# EAGLE design Nixie Board (EAGLE 9.6.2)
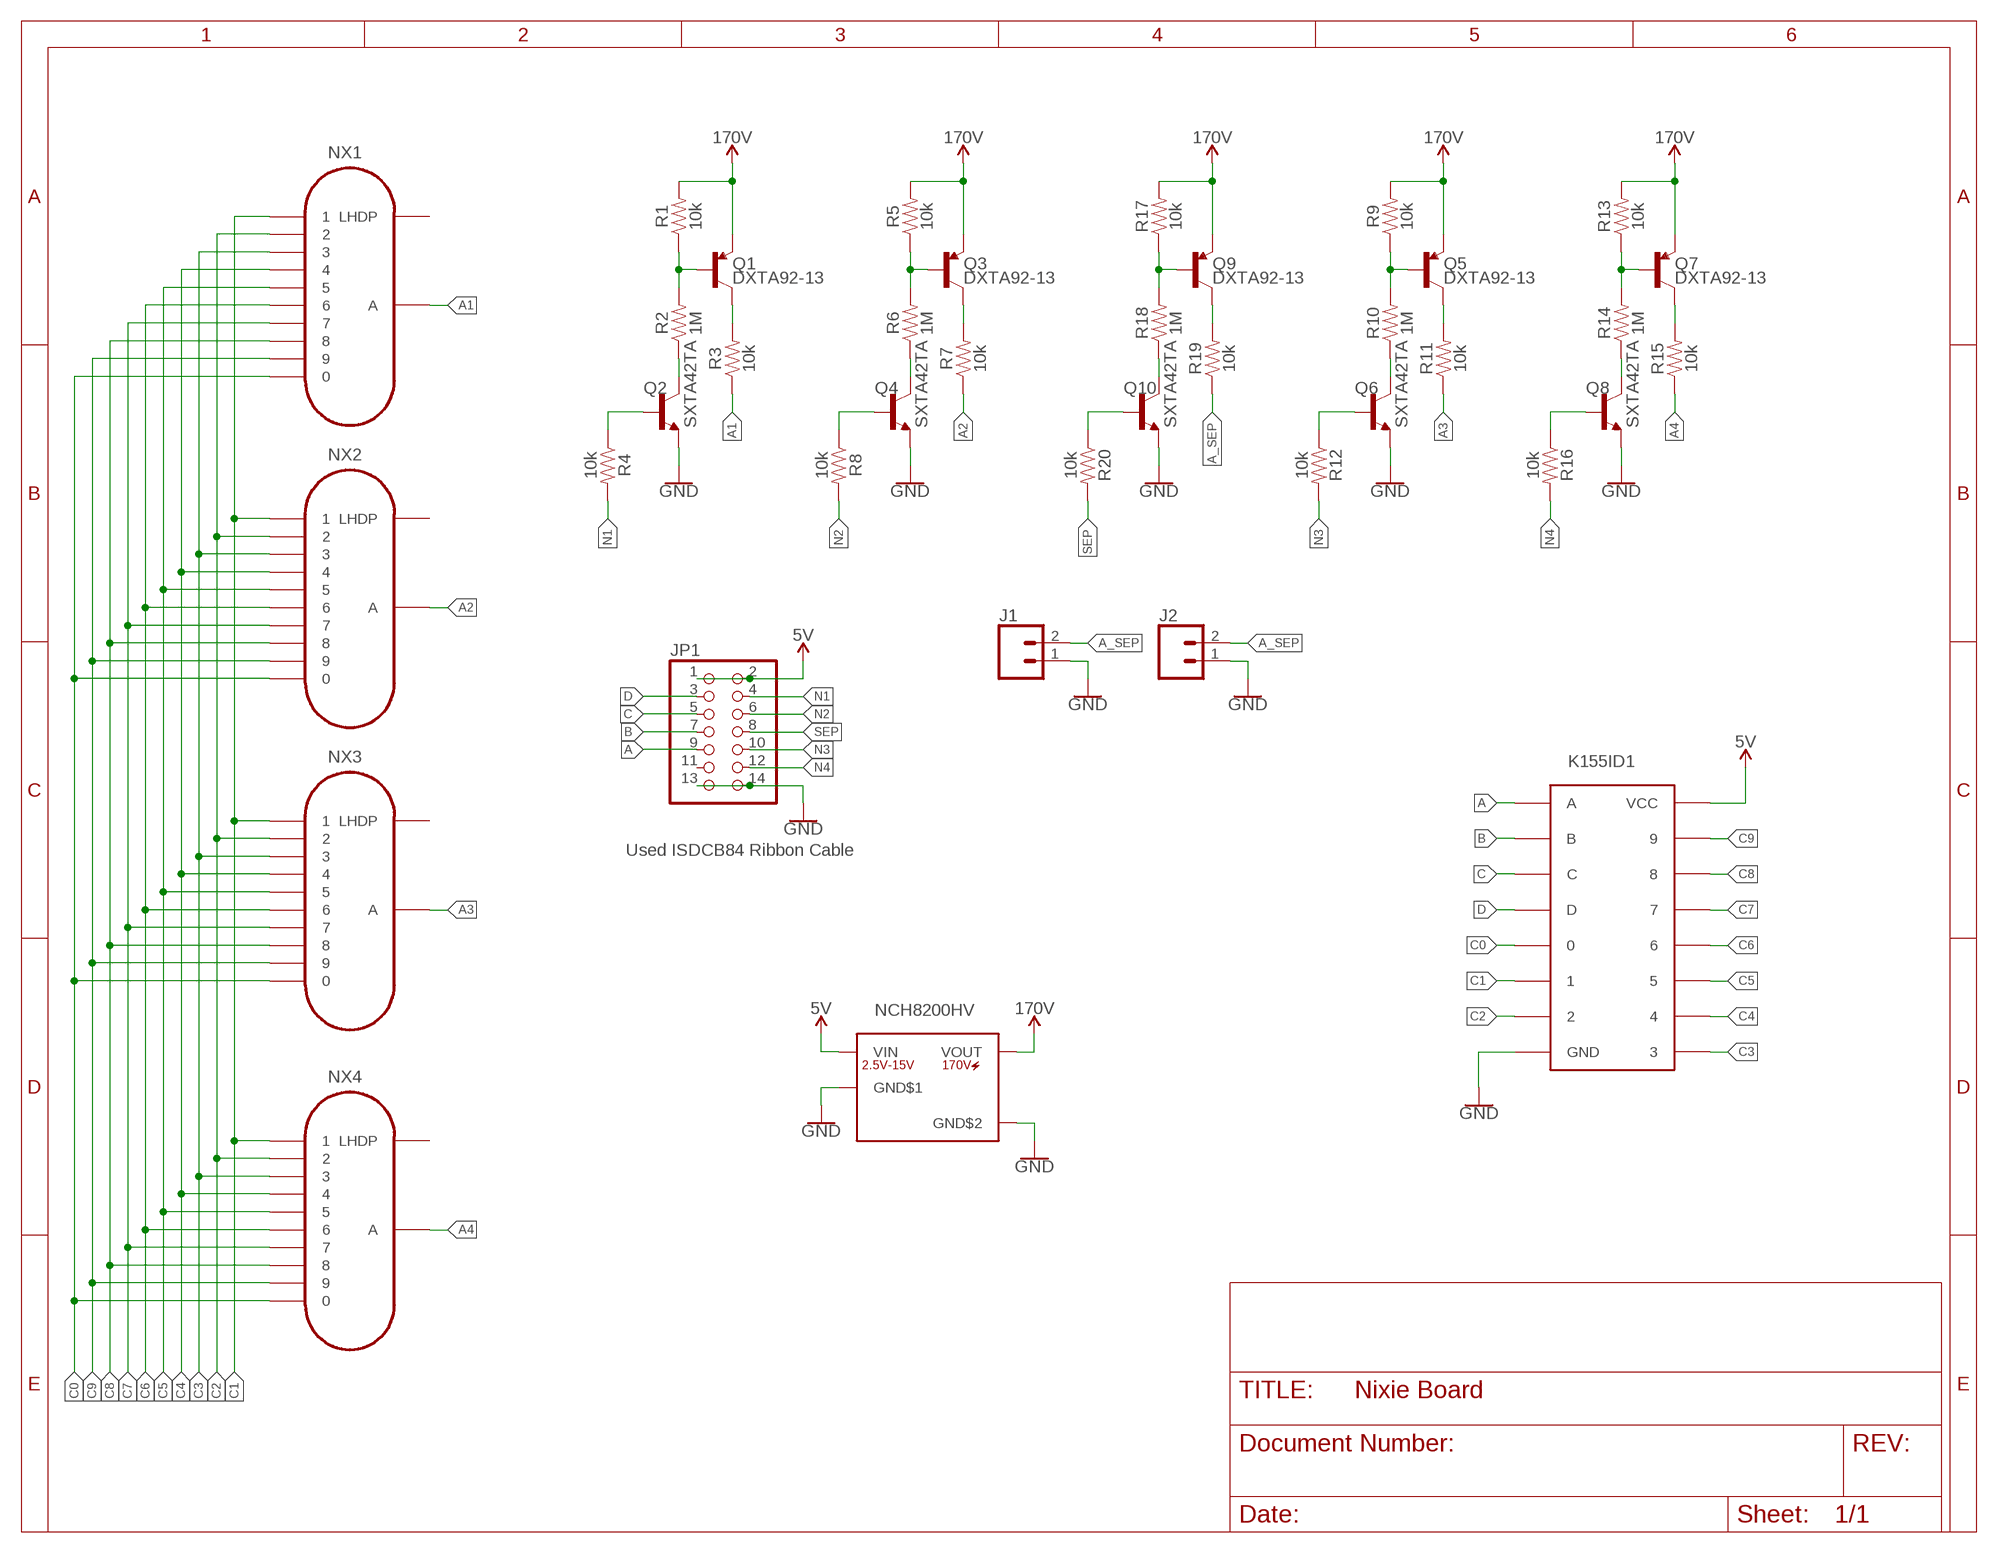
[diagram p0: schematic, sheet 1]

## Parts
J1  CONN_02  [1X02]
J2  CONN_02  [1X02]
JP1  PINHD-2X7  [2X07]
NX1  IN-12BNOHOLE  [IN-12-DSUB-NOHOLE]
NX2  IN-12BNOHOLE  [IN-12-DSUB-NOHOLE]
NX3  IN-12BNOHOLE  [IN-12-DSUB-NOHOLE]
NX4  IN-12BNOHOLE  [IN-12-DSUB-NOHOLE]
Q1  DXTA92-13  [DXTA9213]
Q2  SXTA42TA  [SXTA42TA]
Q3  DXTA92-13  [DXTA9213]
Q4  SXTA42TA  [SXTA42TA]
Q5  DXTA92-13  [DXTA9213]
Q6  SXTA42TA  [SXTA42TA]
Q7  DXTA92-13  [DXTA9213]
Q8  SXTA42TA  [SXTA42TA]
Q9  DXTA92-13  [DXTA9213]
Q10  SXTA42TA  [SXTA42TA]
R1  10k  10KOHM-0603-1/10W-1%  [0603]
R2  1M  1MOHM-0603-1/4W-5%  [0603]
R3  10k  10KOHM-0603-1/10W-1%  [0603]
R4  10k  10KOHM-0603-1/10W-1%  [0603]
R5  10k  10KOHM-0603-1/10W-1%  [0603]
R6  1M  1MOHM-0603-1/4W-5%  [0603]
R7  10k  10KOHM-0603-1/10W-1%  [0603]
R8  10k  10KOHM-0603-1/10W-1%  [0603]
R9  10k  10KOHM-0603-1/10W-1%  [0603]
R10  1M  1MOHM-0603-1/4W-5%  [0603]
R11  10k  10KOHM-0603-1/10W-1%  [0603]
R12  10k  10KOHM-0603-1/10W-1%  [0603]
R13  10k  10KOHM-0603-1/10W-1%  [0603]
R14  1M  1MOHM-0603-1/4W-5%  [0603]
R15  10k  10KOHM-0603-1/10W-1%  [0603]
R16  10k  10KOHM-0603-1/10W-1%  [0603]
R17  10k  10KOHM-0603-1/10W-1%  [0603]
R18  1M  1MOHM-0603-1/4W-5%  [0603]
R19  10k  10KOHM-0603-1/10W-1%  [0603]
R20  10k  10KOHM-0603-1/10W-1%  [0603]
U$1  K155ID1  [DIP16]
U$2  NCH8200HV  [NCH8200HV]

## Nets
5V: JP1.1 JP1.2 U$1.5(VCC) U$2.P$1(VIN)
A: JP1.9 U$1.3(A)
A1: NX1.A R3.1
A2: NX2.A R7.1
A3: NX3.A R11.1
A4: NX4.A R15.1
A_SEP: J1.2 J2.2 R19.1
B: JP1.7 U$1.6(B)
C: JP1.5 U$1.7(C)
C0: NX1.0 NX2.0 NX3.0 NX4.0 U$1.16
C1: NX1.1 NX2.1 NX3.1 NX4.1 U$1.15
C2: NX1.2 NX2.2 NX3.2 NX4.2 U$1.8
C3: NX1.3 NX2.3 NX3.3 NX4.3 U$1.9
C4: NX1.4 NX2.4 NX3.4 NX4.4 U$1.13
C5: NX1.5 NX2.5 NX3.5 NX4.5 U$1.14
C6: NX1.6 NX2.6 NX3.6 NX4.6 U$1.11
C7: NX1.7 NX2.7 NX3.7 NX4.7 U$1.10
C8: NX1.8 NX2.8 NX3.8 NX4.8 U$1.1
C9: NX1.9 NX2.9 NX3.9 NX4.9 U$1.2
D: JP1.3 U$1.4(D)
GND: J1.1 J2.1 JP1.13 JP1.14 Q2.3(E) Q4.3(E) Q6.3(E) Q8.3(E) Q10.3(E) U$1.12(GND) U$2.P$2(GND$1) U$2.P$3(GND$2)
N1: JP1.4 R4.2
N2: JP1.6 R8.2
N3: JP1.10 R12.2
N4: JP1.12 R16.2
N$1: Q1.1(B) R1.1 R2.2
N$2: Q1.2(C) R3.2
N$3: Q2.2(C) R2.1
N$4: Q2.1(B) R4.1
N$5: Q3.1(B) R5.1 R6.2
N$6: Q3.2(C) R7.2
N$7: Q4.2(C) R6.1
N$8: Q4.1(B) R8.1
N$9: Q5.1(B) R9.1 R10.2
N$10: Q5.2(C) R11.2
N$11: Q6.2(C) R10.1
N$12: Q6.1(B) R12.1
N$13: Q7.1(B) R13.1 R14.2
N$14: Q7.2(C) R15.2
N$15: Q8.2(C) R14.1
N$16: Q8.1(B) R16.1
N$17: Q9.1(B) R17.1 R18.2
N$18: Q9.2(C) R19.2
N$19: Q10.2(C) R18.1
N$20: Q10.1(B) R20.1
SEP: JP1.8 R20.2
VCC_1: Q1.3(E) Q3.3(E) Q5.3(E) Q7.3(E) Q9.3(E) R1.2 R5.2 R9.2 R13.2 R17.2 U$2.P$4(VOUT) ; supply symbol labelled 170V
Unconnected: JP1.11 NX1.LHDP NX2.LHDP NX3.LHDP NX4.LHDP

## Notes on the sheet
- K155ID1
- Used ISDCB84 Ribbon Cable
- NCH8200HV

## Library data of the parts
J1 J2 = SparkFun-Connectors:CONN_02: Multi connection point. Often used as Generic Header-pin footprint for 0.1 inch spaced/style header connections On any of the 0.1 inch spaced packages, you can populate with these: Break Away Headers - Straight <https://www.sparkfun.com/products/116> (PRT-00116) Break Away Male Headers - Right Angle <https://www.sparkfun.com/products/553> (PRT-00553) Female Headers <https://www.sparkfun.com/products/115> (PRT-00115) Break Away Headers - Machine Pin <https://www.sparkfun.com/products/117> (PRT-00117) Break Away Female Headers - Swiss Machine Pin <https://www.sparkfun.com/products/743> (PRT-00743) For SCREWTERMINALS and SPRING TERMINALS visit here: Screw Terimnals on SparkFun.com <https://www.sparkfun.com/search/results?term=Screw+Terminals> (5mm/3.5mm/2.54mm spacing) This device is also useful as a general connection point to wire up your design to another part of your project. Our various solder wires solder well into these plated through hole pads. Hook-Up Wire - Assortment (Stranded, 22 AWG) <https://www.sparkfun.com/products/11375> (PRT-11375) Hook-Up Wire - Assortment (Solid Core, 22 AWG) <https://www.sparkfun.com/products/11367> (PRT-11367) View the entire wire category on our website here <https://www.sparkfun.com/categories/141> Special notes: Molex polarized connector foot print use with: PRT-08233 with associated crimp pins and housings. 2.54_SCREWTERM for use with PRT-10571. 3.5mm Screw Terminal footprints for PRT-08084 5mm Screw Terminal footprints for use with PRT-08432; MPN: INS-1
JP1 = pinhead:PINHD-2X7: PIN HEADER; MPN: 30314-6002HB
NX1-NX4 = nixies-us:IN-12B: IN-12B: medium numeric topview nixie tube; MPN: IN-12B
Q1 Q3 Q5 Q7 Q9 = DXTA92-13:DXTA92-13: Bipolar Transistors - BJT 1000mW -300Vceo PNP SURFACE MOUNT TRANSISTOR Source: Datasheet <https://www.diodes.com/assets/Datasheets/ds31159.pdf>; ARROW_PART_NUMBER: DXTA92-13; ARROW_PRICE-STOCK: https://www.arrow.com/en/products/dxta92-13/diodes-incorporated?region=nac; DESCRIPTION: Bipolar Transistors - BJT 1000mW -300Vceo PNP SURFACE MOUNT TRANSISTOR; HEIGHT: 1.6mm; MANUFACTURER_NAME: Diodes Inc.; MANUFACTURER_PART_NUMBER: DXTA92-13; MOUSER_PART_NUMBER: 621-DXTA92-13; MOUSER_PRICE-STOCK: https://www.mouser.com/Search/Refine.aspx?Keyword=621-DXTA92-13; MPN: DXTA92-13
Q2 Q4 Q6 Q8 Q10 = SXTA42TA:SXTA42TA: Diodes Inc SXTA42TA NPN High Voltage Bipolar Transistor, 500 mA, 300 V, 4-Pin SOT-89 Source: Datasheet <https://www.diodes.com/assets/Datasheets/SXTA42.pdf>; ARROW_PART_NUMBER: SXTA42TA; ARROW_PRICE-STOCK: https://www.arrow.com/en/products/sxta42ta/diodes-incorporated?region=nac; DESCRIPTION: Diodes Inc SXTA42TA NPN High Voltage Bipolar Transistor, 500 mA, 300 V, 4-Pin SOT-89; HEIGHT: 1.5mm; MANUFACTURER_NAME: Diodes Inc.; MANUFACTURER_PART_NUMBER: SXTA42TA; MOUSER_PART_NUMBER: 522-SXTA42TA; MOUSER_PRICE-STOCK: https://www.mouser.co.uk/ProductDetail/Diodes-Incorporated/SXTA42TA?qs=GBLSl2AkiruGQsPJmKRQDg%3D%3D; MPN: SXTA42TA
R1 R3-R5 R7-R9 R11-R13 R15-R17 R19 R20 = SparkFun-Resistors:10KOHM: 10kΩ resistor A resistor is a passive two-terminal electrical component that implements electrical resistance as a circuit element. Resistors act to reduce current flow, and, at the same time, act to lower voltage levels within circuits. - Wikipedia; MPN: ESR03EZPJ103; PROD_ID: RES-00824
R2 R6 R10 R14 R18 = SparkFun-Resistors:1MOHM: 1MΩ resistor A resistor is a passive two-terminal electrical component that implements electrical resistance as a circuit element. Resistors act to reduce current flow, and, at the same time, act to lower voltage levels within circuits. - Wikipedia; MPN: ERJ-3EKF1004V; PROD_ID: RES-07868
U$1 = SparkFun-IC-Logic:K155ID1; MPN: K155ID1
U$2 = nixies-us:NCH8200HV; MPN: NCH8200HV

## Board
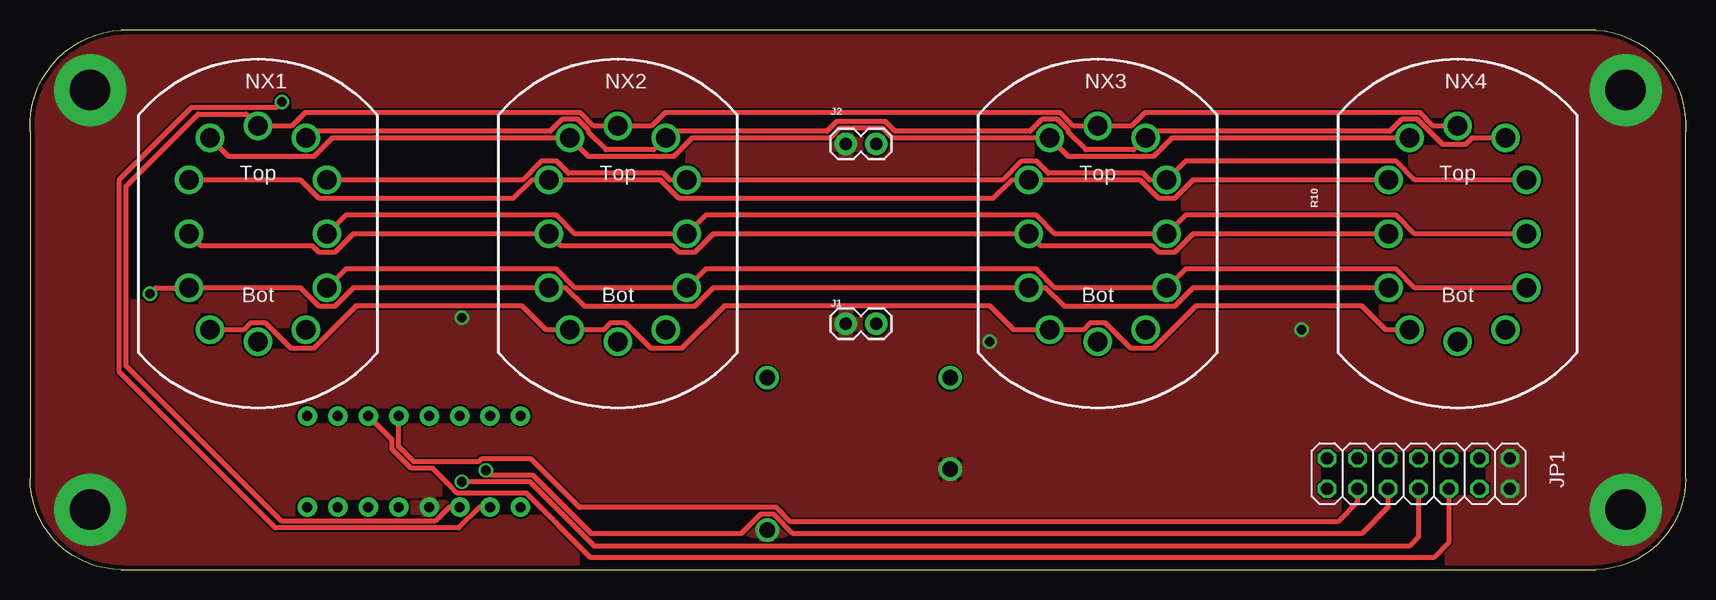
[diagram p1: board, top side]
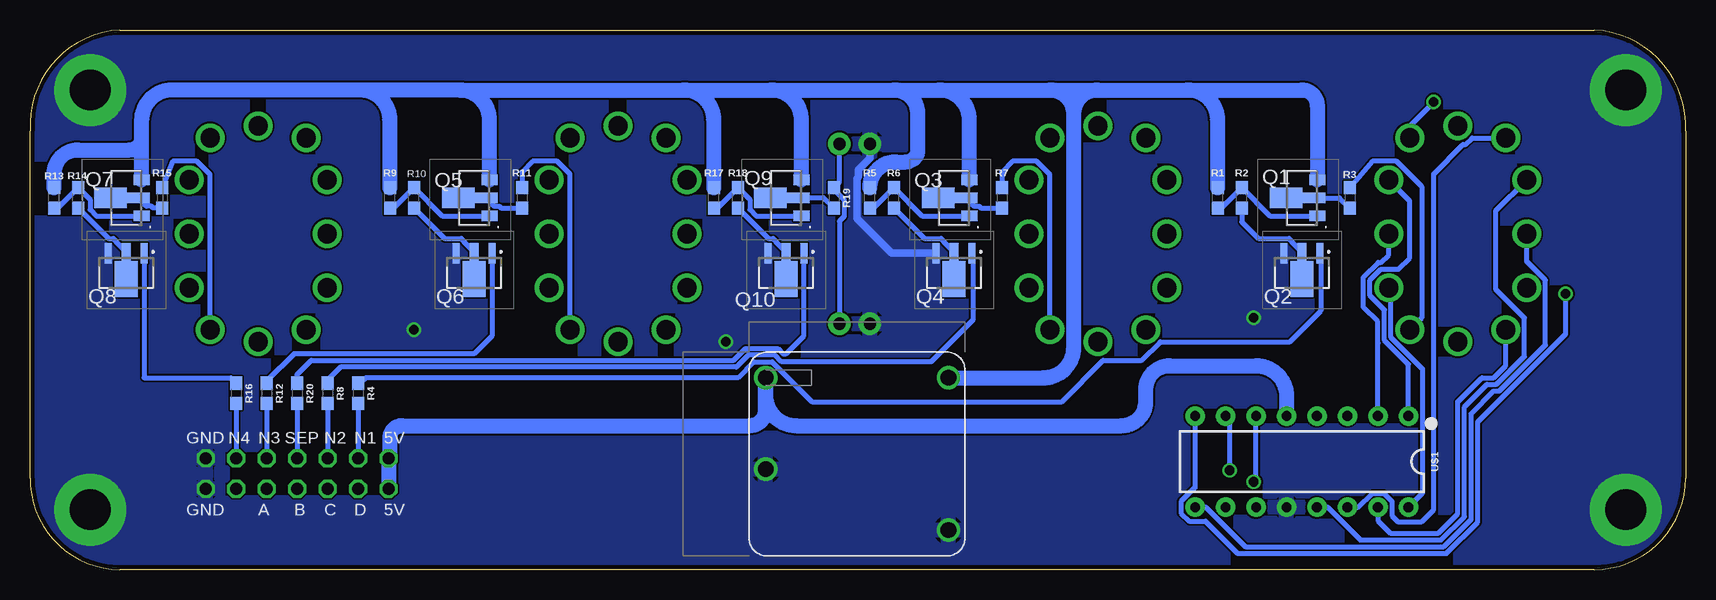
[diagram p2: board, bottom side, seen from below]

Size 138.01 x 45 mm. Coordinates in mm from the lower left corner, seen from the top.
Outline: 7.62,0 130.52,0 arc90 138,7.62 138,36.56 arc90 130.52,45 7.62,45 arc90 0,36.56 0,7.62 arc90 7.62,0
Copper layers (1*16): Top 0.035559375mm / dielectric 1.6mm / Bottom 0.035559375mm
Design rules "oshpark-2layer": minimum track width 6mil, minimum drill 10mil, track to track 6mil, track to pad 6mil, pad to pad 6mil, via to via 6mil, smd to smd 6mil, copper to edge 15mil, drill to drill 6mil, minimum pad ring 5mil, minimum via ring 5mil, stop-mask expansion 2.5mil, vias tented up to drill 0mil, thermal gap 10mil

### Footprints (pad centres in the part's own frame; a part is rotated, then mirrored left to right if it is on the bottom)
1X02 = drill 1.016 pad 1.88: 1 0,0; 2 2.54,0
2X07 = drill 1.016 octagon: 1 -7.62,-1.27; 2 -7.62,1.27; 3 -5.08,-1.27; 4 -5.08,1.27; 5 -2.54,-1.27; 6 -2.54,1.27; 7 0,-1.27; 8 0,1.27; 9 2.54,-1.27; 10 2.54,1.27; 11 5.08,-1.27; 12 5.08,1.27; 13 7.62,-1.27; 14 7.62,1.27
IN-12-DSUB-NOHOLE = drill 1.6: 0 5.75,-4.5; 1 -4,-8; 2 -5.75,-4.5; 3 -5.75,0; 4 -5.75,4.5; 5 -4,8; 6 0,9; 7 4,8; 8 5.75,4.5; 9 5.75,0; A 4,-8; LHDP 0,-9
DXTA9213 = smd 0.9 x 1.3: 1 -1.5,-1.3; 3 1.5,-1.3 | smd 0.9 x 1.9: 2 0,-1 | smd 1.7 x 2.7: 4 0,1.3
SXTA42TA = smd 0.58 x 1.73: 1 -1.5,-1.385; 3 1.5,-1.385 | smd 0.76 x 1.5: 2 0,-1.5 | smd 1.933 x 3.03: 4 0,0.765
0603 = smd 1.1 x 1: 1 -0.85,0; 2 0.85,0
DIP16 = drill 0.813 pad 1.626: 1 -8.89,-3.81; 2 -6.35,-3.81; 3 -3.81,-3.81; 4 -1.27,-3.81; 5 1.27,-3.81; 6 3.81,-3.81; 7 6.35,-3.81; 8 8.89,-3.81; 9 8.89,3.81; 10 6.35,3.81; 11 3.81,3.81; 12 1.27,3.81; 13 -1.27,3.81; 14 -3.81,3.81; 15 -6.35,3.81; 16 -8.89,3.81
NCH8200HV = drill 1.3: P$1 -7.62,6.35; P$2 -7.62,-1.27; P$3 7.62,-6.35; P$4 7.62,6.35

### Placement (x,y rotation side)
J1  68,20.5 0 top
J2  68,35.5 0 top
JP1  115.74,8 0 top
NX1  19,28 0 top
NX2  49,28 0 top
NX3  89,28 0 top
NX4  119,28 0 top
Q1  32,31 90 bottom
Q2  32,25 180 bottom
Q3  61,31 90 bottom
Q4  61,25 180 bottom
Q5  101,31 90 bottom
Q6  101,25 180 bottom
Q7  130,31 90 bottom
Q8  130,25 180 bottom
Q9  75,31 90 bottom
Q10  75,25 180 bottom
R1  39,31 90 bottom
R2  37,31 90 bottom
R3  28,31 270 bottom
R4  110.66,14.7 270 bottom
R5  68,31 90 bottom
R6  66,31 90 bottom
R7  57,31 270 bottom
R8  113.2,14.7 270 bottom
R9  108,31 90 bottom
R10  106,31 90 bottom
R11  97,31 270 bottom
R12  118.28,14.7 270 bottom
R13  136,31 90 bottom
R14  134,31 90 bottom
R15  127,31 270 bottom
R16  120.82,14.7 270 bottom
R17  81,31 90 bottom
R18  79,31 90 bottom
R19  71,31 270 bottom
R20  115.74,14.7 270 bottom
U$1  32,9 180 bottom
U$2  69.07,9.64 0 bottom

### Tracks (layer width: path | path; a pad name or v marks a point on that pad's centre or on a via)
5V
  Bottom 1.27: U$1.5 33.27,14.46 arc-90 35.81,17 43,17 arc-90 45,15 45,14 arc90 47,12 74.15,12 arc90 76.69,14.54 U$2.P$1 76.69,13.31 arc90 78,12 107,12 arc-90 108,11 108,9.39 arc90 JP1.2 JP1.1
A
  Top 0.406: JP1.9 118.28,2.28 117,1 46.74,1 41.38,6.36 35.61,6.36 35.05,6.92 35.05,6.96 33.56,8.44 31.77,8.44 30.17,10.04 30.17,10.83 U$1.3
A1
  Bottom 0.406: NX1.A 22,21 22,31.95 24.11,34.06 26.1,34.06 R3.1
A2
  Bottom 0.406: NX2.A 53,32.95 54.11,34.06 56.1,34.06 57,33.15 R7.1
A3
  Bottom 0.406: NX3.A 93,33 94.06,34.06 96.1,34.06 97,33.15 R11.1
A4
  Bottom 0.406: NX4.A 123,32.95 124.11,34.06 126.1,34.06 R15.1
A_SEP
  Bottom 0.406: J2.2 70.54,32.31 R19.1 71,31.7 70.15,30.85 70.15,29.45 70.54,29.06 J1.2
B  (via drill 0.8)
  Top 0.406: JP1.7 115.74,2.74 114.96,1.96 47.05,1.96 41.69,7.31 v36,7.31
  Bottom 0.406: v36,7.31 35.81,7.5 U$1.6
C  (via drill 0.8)
  Top 0.406: JP1.5 113.2,5.2 111,3 63.62,3 62,4.62 60.9,4.62 59.29,3 46.79,3 41.92,7.87 38.4,7.87 v38,8.27
  Bottom 0.406: v38,8.27 38,12.46 U$1.7
C0
  Top 0.406: NX4.0 115.45,23.5 113.9,25.06 96.31,25.06 NX3.0 85.45,23.5 83.9,25.06 56.31,25.06 NX2.0 45.45,23.5 43.9,25.06 26.31,25.06 NX1.0
  Bottom 0.406: U$1.16 21.95,6.36 21.95,16.74 24.56,19.36 24.56,23.31 NX1.0
C1
  Top 0.406: NX4.1 113,20 111,22 97.2,22 93.65,18.44 91.76,18.44 89.65,20.56 88.36,20.56 87.8,20 NX3.1 82,20 80,22 57.88,22 54.32,18.44 51.76,18.44 49.65,20.56 48.36,20.56 47.8,20 NX2.1 43,20 41,22 27.2,22 23.65,18.44 21.76,18.44 19.65,20.56 18.36,20.56 17.8,20 NX1.1
  Bottom 0.406: U$1.15 25.65,4.08 24.6,3.02 20.63,3.02 19,4.65 19,13.98 16.99,16 16,16 15,17 NX1.1
C2  (via drill 0.8)
  Top 0.406: NX4.2 96.95,23.5 95.4,21.94 86.22,21.94 84.66,23.5 NX3.2 56.95,23.5 55.4,21.94 46.22,21.94 44.66,23.5 NX2.2 26.95,23.5 25.4,21.94 24.11,21.94 22.55,23.5 NX1.2 10.5,23.5 v10,23
  Bottom 0.406: U$1.8 40.89,6.84 42.06,5.67 42.06,4.71 41.38,4.02 40.03,4.02 37.35,1.34 19.94,1.34 17.33,3.95 17.33,12.31 10,19.63 v10,23
C3
  Top 0.406: NX4.3 96.95,28 95.4,26.44 94.11,26.44 93.55,27 84.25,27 NX3.3 56.95,28 55.4,26.44 54.11,26.44 53.55,27 44.25,27 NX2.3 26.95,28 25.4,26.44 24.11,26.44 23.55,27 14.25,27 NX1.3
  Bottom 0.406: U$1.9 40.01,5.19 36.72,1.9 20.17,1.9 17.89,4.18 17.89,13 16,14.88 15.54,14.88 11.7,18.73 11.7,24.14 13.25,25.7 NX1.3
C4
  Top 0.406: NX4.4 96.95,32.5 95.4,30.94 94.11,30.94 92.55,32.5 NX3.4 81.84,32.5 80.29,30.94 54.11,30.94 52.55,32.5 NX2.4 41.84,32.5 40.29,30.94 24.11,30.94 22.55,32.5 NX1.4
  Bottom 0.406: U$1.13 29.85,5.19 27.12,2.46 20.4,2.46 18.44,4.42 18.44,13.56 16.56,15.44 15.77,15.44 13.45,17.77 13.45,20.99 15.81,23.35 15.81,29.94 NX1.4
C5
  Top 0.406: NX4.5 95.2,36 93.65,34.44 86.56,34.44 NX3.5 71.88,36 71.08,36.8 67.47,36.8 66.67,36 55.2,36 53.65,34.44 46.56,34.44 NX2.5 25.2,36 23.65,34.44 16.56,34.44 NX1.5
  Bottom 0.406: U$1.14 27.31,5.19 26.14,6.36 25.17,6.36 24.49,5.67 24.49,4.48 24,4 22,4 21,5 21,33 18.56,35.44 18.36,35.44 17.8,36 NX1.5
C6
  Top 0.406: NX4.6 116.99,37 115.88,38.11 92.92,38.11 91.8,37 NX3.6 86.99,37 85.88,38.11 52.92,38.11 51.8,37 NX2.6 46.99,37 45.88,38.11 22.92,38.11 21.8,37 NX1.6 18,38 14,38 8,32 8,17 20.98,4.02 33.76,4.02 34.93,5.19 U$1.11
C7  (via drill 0.8)
  Top 0.406: NX4.7 120.2,36 119.65,35.44 117.76,35.44 115.65,37.56 114.36,37.56 113.36,36.56 93.56,36.56 NX3.7 92.01,35 88,35 86.56,36.45 86.56,36.64 85.65,37.56 84.36,37.56 83.36,36.56 72.11,36.56 71.31,37.35 67.24,37.35 66.44,36.56 53.56,36.56 NX2.7 52.01,35 48,35 46.56,36.45 46.56,36.64 45.65,37.56 44.36,37.56 43.36,36.56 23.56,36.56 NX1.7 | U$1.10 37.47,5.19 35.74,3.46 20.45,3.46 7.44,16.47 7.44,32.53 13.47,38.56 20.56,38.56 v21,39
  Bottom 0.406: v21,39 23,37 NX1.7
C8
  Top 0.406: NX4.8 115.45,32.5 113.9,34.06 96.31,34.06 NX3.8 93.34,32.5 92.79,33.06 84.89,33.06 83.9,34.06 82.61,34.06 81.05,32.5 NX2.8 53.34,32.5 52.79,33.06 44.89,33.06 43.9,34.06 42.61,34.06 41.05,32.5 NX1.8
  Bottom 0.406: U$1.1 23.11,17.12 25.12,19.12 25.12,21.66 26.31,22.86 26.31,24.14 25.4,25.06 23.95,25.06 23,26 23,30.75 NX1.8
C9
  Top 0.406: NX4.9 115.45,28 113.9,29.56 96.31,29.56 NX3.9 85.45,28 83.9,29.56 56.31,29.56 NX2.9 45.45,28 43.9,29.56 26.31,29.56 NX1.9
  Bottom 0.406: U$1.2 25.65,18.87 25.68,18.89 25.68,20.67 26.87,21.86 26.87,24.38 25.63,25.61 25.39,25.61 24.75,26.25 NX1.9
D
  Top 0.406: JP1.3 110.66,5.66 109,4 63.41,4 62.24,5.17 45.83,5.17 41.78,9.22 37.61,9.22 37.38,9 32,9 30.73,10.27 U$1.4
GND  (via drill 0.8, 3.4 pad 6)
  Bottom 0.61: J2.1 68,34.3 68.96,33.34 68.96,32.79 69,32.69 69.1,32.59 69.1,29.28 66.2,26.39 Q4.3
  other vias: 80,19 106,20 36,21 5,5 5,40 133,40 133,5
  pour Bottom: 139,46 139,-4 -4,-4 -4,45 -2,45 -2,46
  pour Top: 139,46 139,-4 -4,-4 -4,46
N1
  Bottom 0.406: R4.2 JP1.4
N2
  Bottom 0.406: R8.2 JP1.6
N3
  Bottom 0.406: R12.2 JP1.10
N4
  Bottom 0.406: R16.2 JP1.12
N$1
  Bottom 0.406: R1.1 38.7,30.15 R2.2 34.65,29.5 Q1.1
N$2
  Bottom 0.406: R3.2 28.85,31 Q1.2
N$3
  Bottom 0.406: R2.1 37,29 35.61,27.61 33.07,27.61 32.86,27.4 32.86,27.35 Q2.2
N$4
  Bottom 0.406: R4.1 110.45,15.55 110,16 79,16 77.69,17.32 76.14,17.32 72.83,14 52,14 48.56,17.44 45.36,17.44 43.8,19 33,19 30.43,21.58 30.43,26.31 Q2.1
N$5
  Bottom 0.406: R5.1 67.7,30.15 R6.2 63.65,29.5 Q3.1
N$6
  Bottom 0.406: Q3.2 59.31,30.31 58.91,30.31 58.75,30.15 R7.2
N$7
  Bottom 0.406: R6.1 63.46,27.61 62.07,27.61 61.86,27.4 61.86,27.35 Q4.2
N$8
  Bottom 0.406: Q4.1 59.43,26.31 59.43,20.8 62.91,17.32 75.35,17.32 75.91,17.88 78.14,17.88 79.13,16.88 112.12,16.88 113.2,15.8 R8.1
N$9
  Bottom 0.406: R9.1 107.7,30.15 R10.2 103.65,29.5 Q5.1
N$10
  Bottom 0.406: Q5.2 99.31,30.31 98.91,30.31 98.75,30.15 R11.2
N$11
  Bottom 0.406: R10.1 103.46,27.61 102.07,27.61 101.86,27.4 101.86,27.35 Q6.2
N$12
  Bottom 0.406: Q6.1 99.5,19.5 101,18 116,18 118.28,15.72 R12.1
N$13
  Bottom 0.406: R13.1 135.7,30.15 R14.2 133.01,30.86 133.01,30 132.51,29.5 Q7.1
N$14
  Bottom 0.406: R15.2 127.75,30.15 127.91,30.31 128.31,30.31 Q7.2
N$15
  Bottom 0.406: R14.1 131.46,27.61 131.07,27.61 130.86,27.4 130.86,27.35 Q8.2
N$16
  Bottom 0.406: Q8.1 128.5,16 121.27,16 R16.1
N$17
  Bottom 0.406: R17.1 80.7,30.15 R18.2 78.01,30.86 78.01,30 77.51,29.5 Q9.1
N$18
  Bottom 0.406: R19.2 71.85,31 Q9.2
N$19
  Bottom 0.406: R18.1 76.46,27.61 76.07,27.61 75.86,27.4 75.86,27.35 Q10.2
N$20
  Bottom 0.406: R20.1 115.74,16.26 114.56,17.44 79.36,17.44 78.37,18.43 75.68,18.43 75.25,18 75,18 73.5,19.5 Q10.1
SEP
  Bottom 0.406: R20.2 JP1.8
VCC_1
  Bottom 1.27: 102.24,40 110.54,40 | 102.24,40 83.54,40 | 83.54,40 76.24,40 | 76.24,40 66,40 | 66,40 62.24,40 | 62.24,40 53,40 | 53,40 49,40 | 49,40 41.54,40 | 41.54,40 32,40 arc90 30.7,38.7 Q1.3 | R1.2 39,37.46 arc-90 41.54,40 | Q3.3 59.7,37.46 arc-90 62.24,40 | R5.2 arc90 65.85,34 65,34 arc-90 64,35 64,38 arc-90 66,40 | Q9.3 73.7,37.46 arc-90 76.24,40 | R17.2 81,37.46 arc-90 83.54,40 | Q5.3 99.7,37.46 arc-90 102.24,40 | R9.2 108,37.46 arc-90 110.54,40 | Q7.3 128.7,36 | 128.7,36 128.7,37.46 arc90 126.16,40 110.54,40 | U$2.P$4 53.54,15.99 arc-90 51,18.53 51,38 | 51,38 arc-90 53,40 | 51,38 arc90 49,40 | R13.2 136,33 arc90 134,35 129.7,35 arc-90 128.7,36

### Text on the board
bNames: R10 | 5V | N1 | N2 | SEP | N3 | N4 | GND | 5V | D | C | B | A | GND
tStop: Nixie Clock | v1.0 | Designed by Ricardo S